# EAGLE schematic speed sensor (EAGLE 9.5.2)
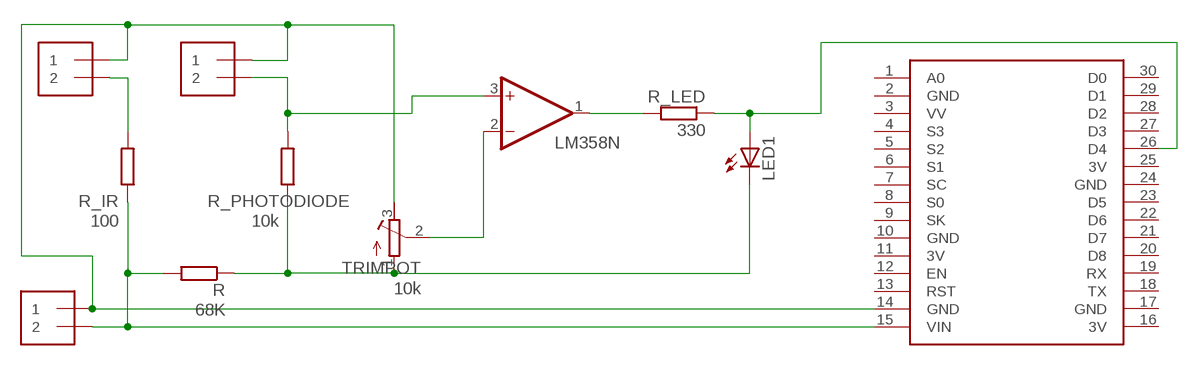
[diagram p0: schematic, sheet 1]

## Parts
5V_VCC_GND  1X2-3.5MM  [1X2-3.5MM]
IC1  LM358N  [DIL08]
IR  1X2-3.5MM  [1X2-3.5MM]
LED1  LED5MM  [LED5MM]
PHOTODIODE  1X2-3.5MM  [1X2-3.5MM]
R  68K  R-EU_0207/10  [0207/10]
R_IR  100  R-EU_0207/10  [0207/10]
R_LED  330  R-EU_0207/10  [0207/10]
R_PHOTODIODE  10k  R-EU_0207/10  [0207/10]
TRIMPOT  10k  R-TRIMM3339P  [RTRIM3339P]
U$1  NODEMCU  [NODEMCU]

## Nets
N$1: 5V_VCC_GND.1 IR.1 PHOTODIODE.1 TRIMPOT.3(E) U$1.14(GND)
N$2: IR.2 R_IR.2
N$3: 5V_VCC_GND.2 R.2 R_IR.1 U$1.15(VIN)
N$4: IC1.3(A:+IN) PHOTODIODE.2 R_PHOTODIODE.2
N$5: LED1.K(C) R.1 R_PHOTODIODE.1 TRIMPOT.1(A)
N$6: IC1.2(A:-IN) TRIMPOT.2(S)
N$7: IC1.1(A:OUT) R_LED.2
N$8: LED1.A R_LED.1 U$1.26(D4)
Unconnected: IC1.5(B:+IN) IC1.6(B:-IN) IC1.7(B:OUT) U$1.1(A0) U$1.3(VV) U$1.4(S3) U$1.5(S2) U$1.6(S1) U$1.7(SC) U$1.8(S0) U$1.9(SK) U$1.12(EN) U$1.13(RST) U$1.18(TX) U$1.19(RX) U$1.20(D8) U$1.21(D7) U$1.22(D6) U$1.23(D5) U$1.27(D3) U$1.28(D2) U$1.29(D1) U$1.30(D0)

## Power pins joined to a net without a drawn wire
3V: U$1.11(3V) U$1.16(3V) U$1.25(3V)
GND: U$1.2(GND) U$1.10(GND) U$1.17(GND) U$1.24(GND)
V+: IC1.8(P:V+)
V-: IC1.4(P:V-)

## Library data of the parts
5V_VCC_GND IR PHOTODIODE = adafruit:1X2: 3.5mm Terminal block http://www.ladyada.net/library/pcb/eaglelibrary.html
IC1 = linear:LM358: OP AMP also LM158; LM258; LM2904 Source: http://cache.national.com/ds/LM/LM158.pdf
LED1 = adafruit:LED: LED OSRAM: - CHIPLED LG R971, LG N971, LY N971, LG Q971, LY Q971, LO R971, LY R971 LH N974, LH R974 LS Q976, LO Q976, LY Q976 LO Q996 - Hyper CHIPLED LW Q18S LB Q993, LB Q99A, LB R99A - SideLED LS A670, LO A670, LY A670, LG A670, LP A670 LB A673, LV A673, LT A673, LW A673 LH A674 LY A675 LS A676, LA A676, LO A676, LY A676, LW A676 LS A679, LY A679, LG A679 - Hyper Micro SIDELED® LS Y876, LA Y876, LO Y876, LY Y876 LT Y87S - SmartLED LW L88C, LW L88S LB L89C, LB L89S, LG L890 LS L89K, LO L89K, LY L89K LS L896, LA L896, LO L896, LY L896 - TOPLED LS T670, LO T670, LY T670, LG T670, LP T670 LSG T670, LSP T670, LSY T670, LOP T670, LYG T670 LG T671, LOG T671, LSG T671 LB T673, LV T673, LT T673, LW T673 LH T674 LS T676, LA T676, LO T676, LY T676, LB T676, LH T676, LSB T676, LW T676 LB T67C, LV T67C, LT T67C, LS T67K, LO T67K, LY T67K, LW E67C LS E67B, LA E67B, LO E67B, LY E67B, LB E67C, LV E67C, LT E67C LW T67C LS T679, LY T679, LG T679 LS T770, LO T770, LY T770, LG T770, LP T770 LB T773, LV T773, LT T773, LW T773 LH T774 LS E675, LA E675, LY E675, LS T675 LS T776, LA T776, LO T776, LY T776, LB T776 LHGB T686 LT T68C, LB T68C - Hyper Mini TOPLED® LB M676 - Mini TOPLED Santana® LG M470 LS M47K, LO M47K, LY M47K Source: http://www.osram.convergy.de/
R R_IR R_LED R_PHOTODIODE = rcl:R-EU_: RESISTOR, European symbol; SPICEPREFIX: R
TRIMPOT = rcl:R-TRIMM: Trimm resistor; SPICEMODEL: X; SPICEPREFIXL: POT
U$1 = nodemcu:NODEMCU

## Net classes
0 default: width 1 mm, clearance 0.762 mm
1 vcc: width 1 mm, clearance 0.762 mm to class 0
2 gnd: width 1 mm, clearance 0.762 mm to class 0